# EAGLE schematic MotorControllerV2 (EAGLE 9.3.0)

## Sheet 1 of 2
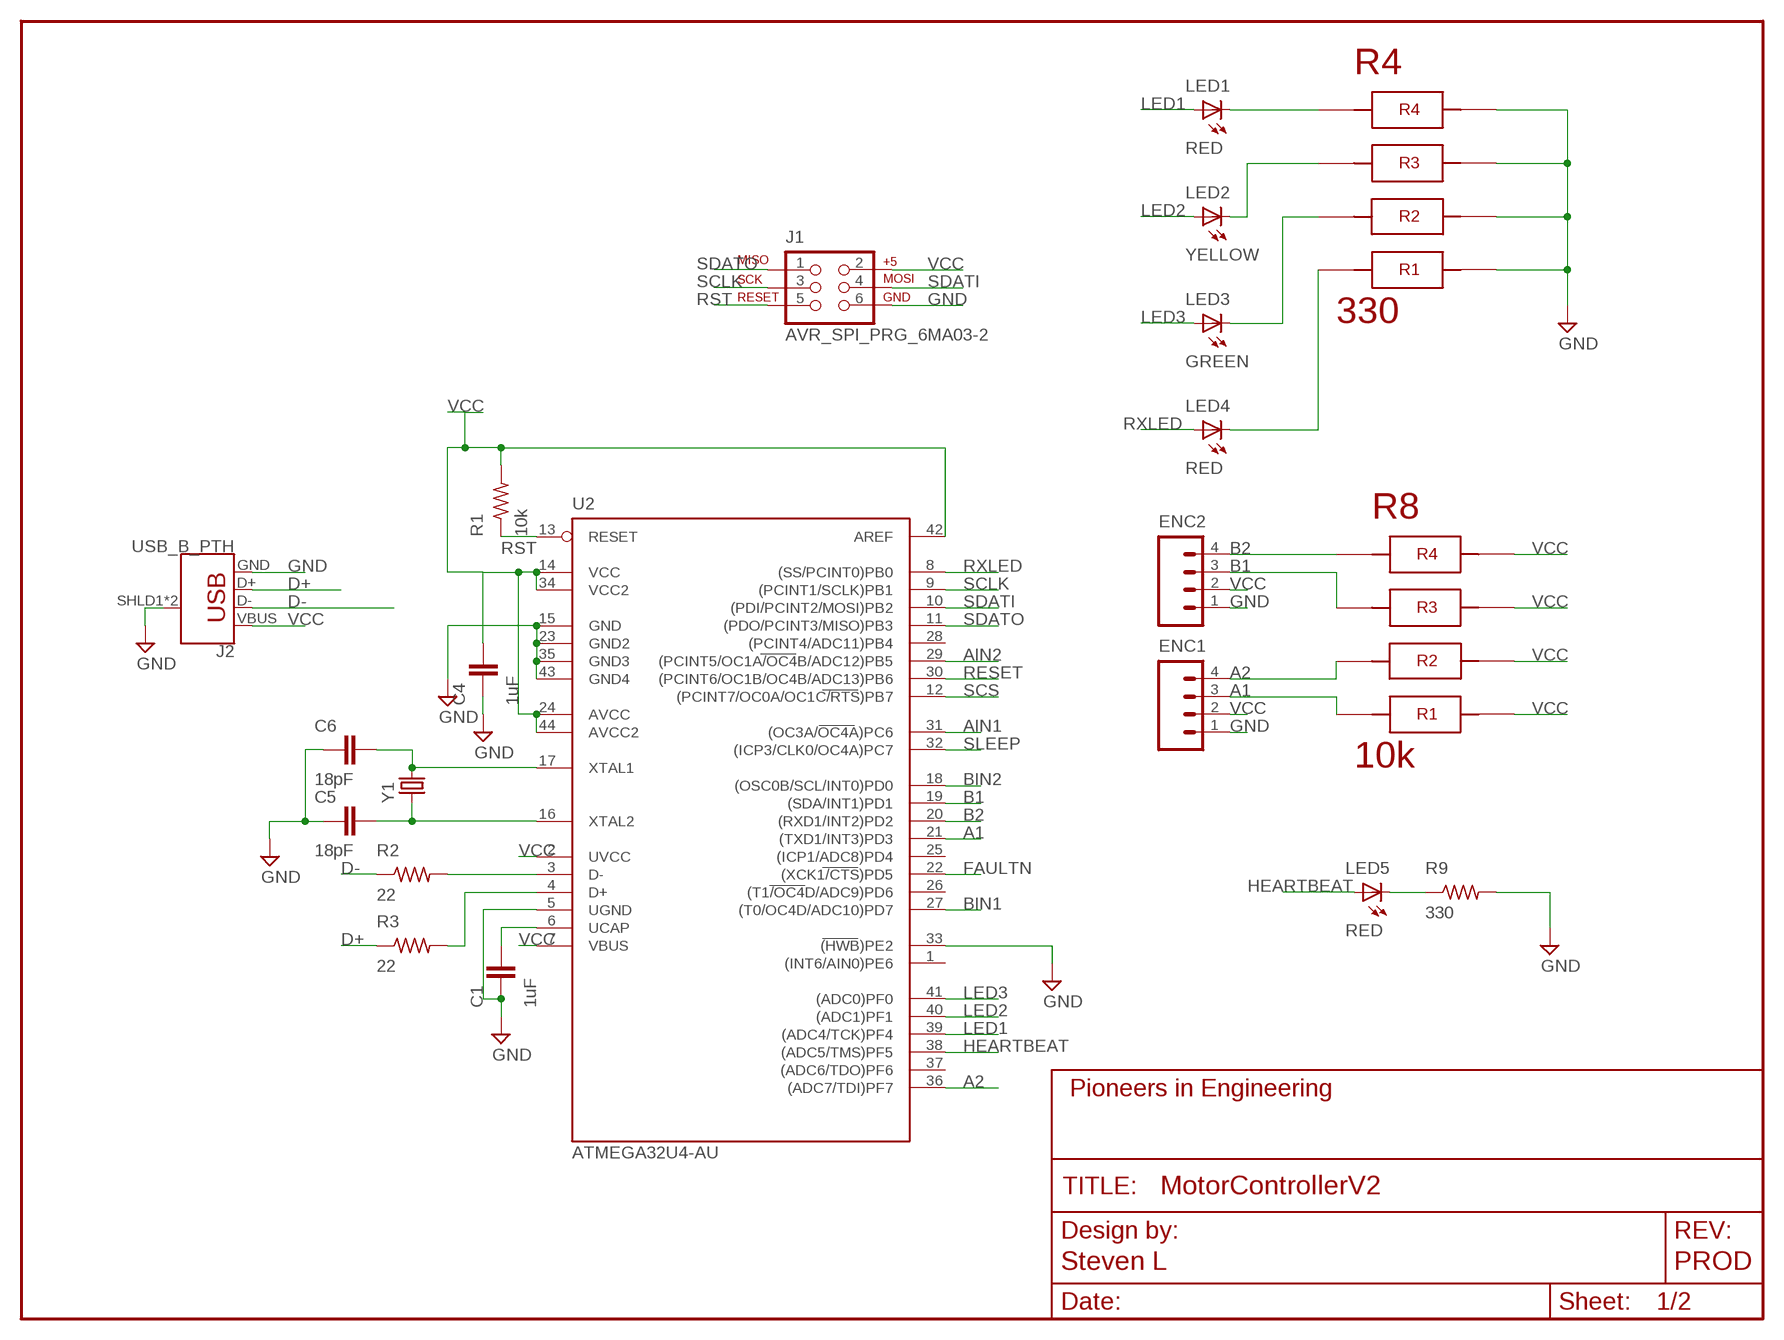
[diagram p0: schematic, sheet 1]
FRAME1 (FRAME_SCHEMATIC): AUTHOR: Steven L; REVISION: PROD

### Parts
C1  1uF  CAP0603-CAP  [0603-CAP]
C4  1uF  CAP0603-CAP  [0603-CAP]
C5  18pF  CAP0603-CAP  [0603-CAP]
C6  18pF  CAP0603-CAP  [0603-CAP]
ENC1  M041X04-MTA  [1X04-MTA]
ENC2  M041X04-MTA  [1X04-MTA]
J1  AVR_SPI_PRG_6MA03-2  [MA03-2]
J2  USB_B_PTH  [USB-B-PTH]
LED1  RED  LED1206  [LED-1206]
LED2  YELLOW  LED1206  [LED-1206]
LED3  GREEN  LED1206  [LED-1206]
LED4  RED  LED1206  [LED-1206]
LED5  RED  LED1206  [LED-1206]
R1  10k  R-US_R0603  [R0603]
R2  22  R-US_R0603  [R0603]
R3  22  R-US_R0603  [R0603]
R4  330  4X-0603  [4X-0603]
R8  10k  4X-0603  [4X-0603]
R9  330  R-US_R0603  [R0603]
U2  ATMEGA32U4-AU  [TQFP44]
Y1  CRYSTAL10.5X4.8  [CRYSTAL-SMD-10.5X4.8-2PIN]

### Nets
A1: ENC1.3 R8.8 U2.21((TXD1/INT3)PD3)
A2: ENC1.4 R8.7 U2.36((ADC7/TDI)PF7)
AIN1: U2.31((OC3A/OC4A)PC6) ; also sheet 2
AIN2: U2.29((PCINT5/OC1A/OC4B/ADC12)PB5) ; also sheet 2
B1: ENC2.3 R8.6 U2.19((SDA/INT1)PD1)
B2: ENC2.4 R8.5 U2.20((RXD1/INT2)PD2)
BIN1: U2.27((T0/OC4D/ADC10)PD7) ; also sheet 2
BIN2: U2.18((OSC0B/SCL/INT0)PD0) ; also sheet 2
D+: J2.D+ R3.1
D-: J2.D- R2.1
FAULTN: U2.22((XCK1/CTS)PD5) ; also sheet 2
GND: C1.1 C4.1 C5.1 C6.1 ENC1.1 ENC2.1 J1.6 J2.GND J2.SHLD1(SHIELD) J2.SHLD2(SHIELD) R4.1 R4.2 R4.3 R4.4 R9.2 U2.5(UGND) U2.15(GND) U2.23(GND2) U2.33((HWB)PE2) U2.35(GND3) U2.43(GND4) ; also sheet 2
HEARTBEAT: LED5.A U2.38((ADC5/TMS)PF5)
LED1: LED1.A U2.39((ADC4/TCK)PF4)
LED2: LED2.A U2.40((ADC1)PF1)
LED3: LED3.A U2.41((ADC0)PF0)
N$1: R2.2 U2.3(D-)
N$2: R3.2 U2.4(D+)
N$3: LED4.C R4.8
N$4: LED1.C R4.5
N$5: LED2.C R4.6
N$6: LED3.C R4.7
N$7: C6.2 U2.17(XTAL1) Y1.P$2
N$8: C5.2 U2.16(XTAL2) Y1.P$1
N$9: LED5.C R9.1
N$11: C1.2 U2.6(UCAP)
RESET: U2.30((PCINT6/OC1B/OC4B/ADC13)PB6) ; also sheet 2
RST: J1.5 R1.1 U2.13(RESET)
RXLED: LED4.A U2.8((SS/PCINT0)PB0)
SCLK: J1.3 U2.9((PCINT1/SCLK)PB1) ; also sheet 2
SCS: U2.12((PCINT7/OC0A/OC1C/RTS)PB7) ; also sheet 2
SDATI: J1.4 U2.10((PDI/PCINT2/MOSI)PB2) ; also sheet 2
SDATO: J1.1 U2.11((PDO/PCINT3/MISO)PB3) ; also sheet 2
SLEEP: U2.32((ICP3/CLK0/OC4A)PC7) ; also sheet 2
VCC: C4.2 ENC1.2 ENC2.2 J1.2 J2.VBUS R1.2 R8.1 R8.2 R8.3 R8.4 U2.2(UVCC) U2.7(VBUS) U2.14(VCC) U2.24(AVCC) U2.34(VCC2) U2.42(AREF) U2.44(AVCC2)
Unconnected: U2.1((INT6/AIN0)PE6) U2.25((ICP1/ADC8)PD4) U2.26((T1/OC4D/ADC9)PD6) U2.28((PCINT4/ADC11)PB4) U2.37((ADC6/TDO)PF6)

## Sheet 2 of 2
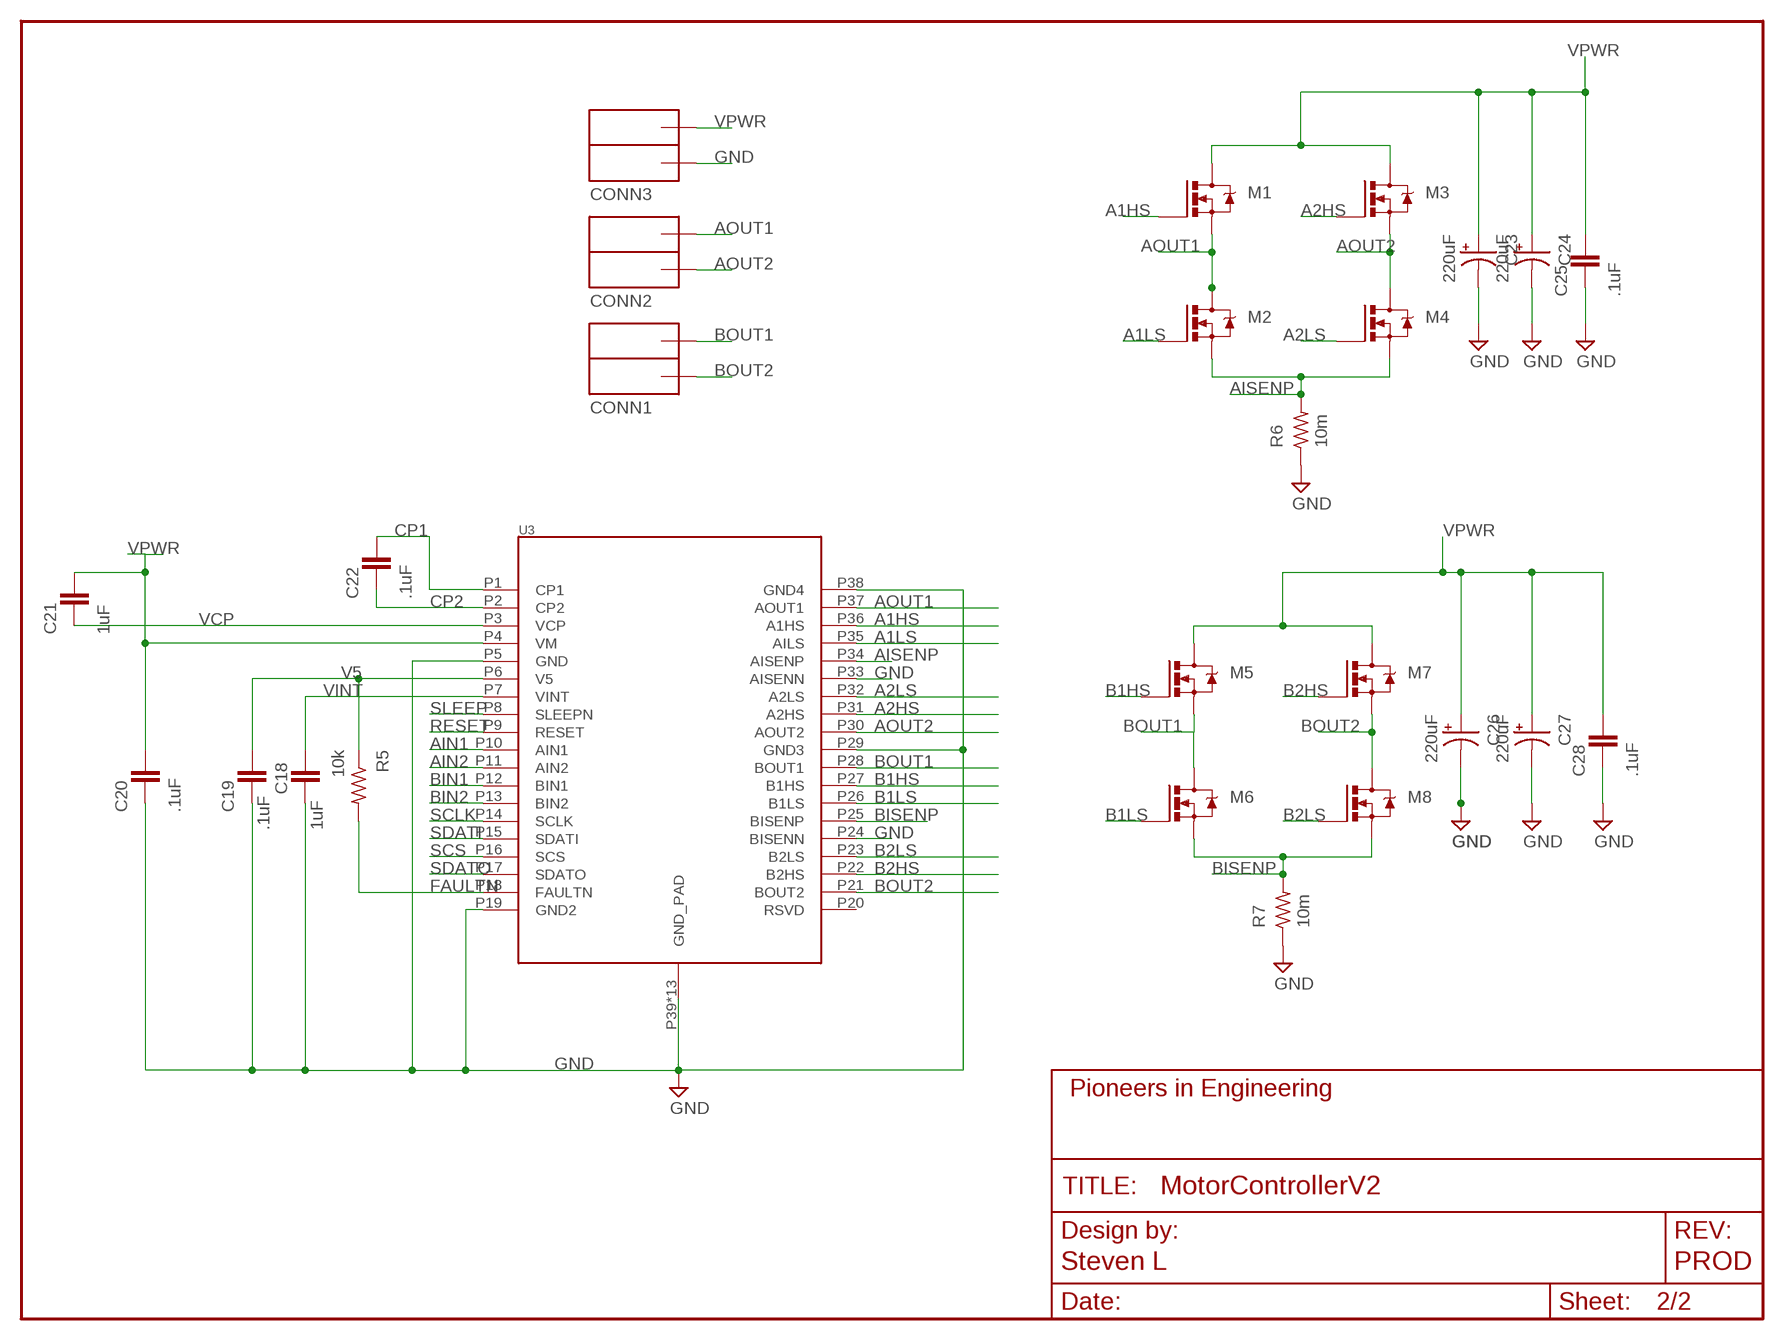
[diagram p1: schematic, sheet 2]
FRAME2 (FRAME_SCHEMATIC): AUTHOR: Steven L; REVISION: PROD

### Parts
C18  1uF  CAP0603-CAP  [0603-CAP]
C19  .1uF  CAP0603-CAP  [0603-CAP]
C20  .1uF  CAP0603-CAP  [0603-CAP]
C21  1uF  CAP0603-CAP  [0603-CAP]
C22  .1uF  CAP0603-CAP  [0603-CAP]
C23  220uF  CAP_POLF80  [NIPPON_F80]
C24  220uF  CAP_POLF80  [NIPPON_F80]
C25  .1uF  CAP0603-CAP  [0603-CAP]
C26  220uF  CAP_POLF80  [NIPPON_F80]
C27  220uF  CAP_POLF80  [NIPPON_F80]
C28  .1uF  CAP0603-CAP  [0603-CAP]
CONN1  ANDERSONVERTICAL  [ANDERSON_VERTICAL]
CONN2  ANDERSONVERTICAL  [ANDERSON_VERTICAL]
CONN3  ANDERSONVERTICAL  [ANDERSON_VERTICAL]
M1  NMOS_CSD17579Q3A  [DNH0008A]
M2  NMOS_CSD17579Q3A  [DNH0008A]
M3  NMOS_CSD17579Q3A  [DNH0008A]
M4  NMOS_CSD17579Q3A  [DNH0008A]
M5  NMOS_CSD17579Q3A  [DNH0008A]
M6  NMOS_CSD17579Q3A  [DNH0008A]
M7  NMOS_CSD17579Q3A  [DNH0008A]
M8  NMOS_CSD17579Q3A  [DNH0008A]
R5  10k  R-US_R0603  [R0603]
R6  10m  R-US_R2512  [R2512]
R7  10m  R-US_R2512  [R2512]
U3  DRV8704  [HTSSOP(38)]

### Nets
A1HS: M1.4(G) U3.P36(A1HS)
A1LS: M2.4(G) U3.P35(AILS)
A2HS: M3.4(G) U3.P31(A2HS)
A2LS: M4.4(G) U3.P32(A2LS)
AIN1: U3.P10(AIN1) ; also sheet 1
AIN2: U3.P11(AIN2) ; also sheet 1
AISENP: M2.1(S) M2.2(S) M2.3(S) M4.1(S) M4.2(S) M4.3(S) R6.2 U3.P34(AISENP)
AOUT1: CONN2.PIN1(OUTB) M1.1(S) M1.2(S) M1.3(S) M2.5(D) M2.6(D) M2.7(D) M2.8(D) M2.9(D) U3.P37(AOUT1)
AOUT2: CONN2.PIN2(OUTA) M3.1(S) M3.2(S) M3.3(S) M4.5(D) M4.6(D) M4.7(D) M4.8(D) M4.9(D) U3.P30(AOUT2)
B1HS: M5.4(G) U3.P27(B1HS)
B1LS: M6.4(G) U3.P26(B1LS)
B2HS: M7.4(G) U3.P22(B2HS)
B2LS: M8.4(G) U3.P23(B2LS)
BIN1: U3.P12(BIN1) ; also sheet 1
BIN2: U3.P13(BIN2) ; also sheet 1
BISENP: M6.1(S) M6.2(S) M6.3(S) M8.1(S) M8.2(S) M8.3(S) R7.2 U3.P25(BISENP)
BOUT1: CONN1.PIN1(OUTB) M5.1(S) M5.2(S) M5.3(S) M6.5(D) M6.6(D) M6.7(D) M6.8(D) M6.9(D) U3.P28(BOUT1)
BOUT2: CONN1.PIN2(OUTA) M7.1(S) M7.2(S) M7.3(S) M8.5(D) M8.6(D) M8.7(D) M8.8(D) M8.9(D) U3.P21(BOUT2)
CP1: C22.2 U3.P1(CP1)
CP2: C22.1 U3.P2(CP2)
FAULTN: R5.2 U3.P18(FAULTN) ; also sheet 1
GND: C18.1 C19.1 C20.1 C23.- C24.- C25.1 C26.- C27.- C28.1 CONN3.PIN2(OUTA) R6.1 R7.1 U3.P5(GND) U3.P19(GND2) U3.P24(BISENN) U3.P29(GND3) U3.P33(AISENN) U3.P38(GND4) U3.P39(GND_PAD) U3.P40(GND_PAD) U3.P41(GND_PAD) U3.P42(GND_PAD) U3.P43(GND_PAD) U3.P44(GND_PAD) U3.P45(GND_PAD) U3.P46(GND_PAD) U3.P47(GND_PAD) U3.P48(GND_PAD) U3.P49(GND_PAD) U3.P50(GND_PAD) U3.P51(GND_PAD) ; also sheet 1
RESET: U3.P9(RESET) ; also sheet 1
SCLK: U3.P14(SCLK) ; also sheet 1
SCS: U3.P16(SCS) ; also sheet 1
SDATI: U3.P15(SDATI) ; also sheet 1
SDATO: U3.P17(SDATO) ; also sheet 1
SLEEP: U3.P8(SLEEPN) ; also sheet 1
V5: C19.2 R5.1 U3.P6(V5)
VCP: C21.1 U3.P3(VCP)
VINT: C18.2 U3.P7(VINT)
VPWR: C20.2 C21.2 C23.+ C24.+ C25.2 C26.+ C27.+ C28.2 CONN3.PIN1(OUTB) M1.5(D) M1.6(D) M1.7(D) M1.8(D) M1.9(D) M3.5(D) M3.6(D) M3.7(D) M3.8(D) M3.9(D) M5.5(D) M5.6(D) M5.7(D) M5.8(D) M5.9(D) M7.5(D) M7.6(D) M7.7(D) M7.8(D) M7.9(D) U3.P4(VM)
Unconnected: U3.P20(RSVD)

## Library data of the parts
C1 C4-C6 C18-C21 C25 C28 = pie:CAP: Capacitor Standard 0603 ceramic capacitor, and 0.1" leaded capacitor.; PIE-INT-REF-NUM: CAPACITOR-GENERIC
C22 = pie:CAP: Capacitor Standard 0603 ceramic capacitor, and 0.1" leaded capacitor.; PIE-INT-REF-NUM: CAPACITOR-GENERIC; VMAX: 16V
C23 C24 C26 C27 = pie:CAP_POL: Capacitor Polarized These are standard SMD and PTH capacitors. Normally 10uF, 47uF, and 100uF in electrolytic and tantalum varieties. Always verify the external diameter of the through hole cap, it varies with capacity, voltage, and manufacturer. The EIA devices should be standard.
CONN1-CONN3 = pie:ANDERSON: 2-pin 25A Anderson Connector http://www.alliedelec.com/images/products/datasheets/bm/ANDERSON_POWER_PRODUCTS/70162018.pdf; PIE-INT-REF-NUM: Anderson
ENC1 ENC2 = pie:M04: 4-pin 0.1-inch header and MTA connector; PIE-INT-REF-NUM: MTA
J1 = pie:AVR_SPI_PRG_6: AVR ISP 6 Pin This is the reduced ISP connector for AVR programming. Common on Arduino. This footprint will take up less PCB space and can be used with a 10-pin to 6-pin adapter such as SKU: BOB-08508; PIE-INT-REF-NUM: BULK-STOCK
J2 = SparkFun-Connectors:USB_B: USB Type B Connector SparkFun Products: SparkFun Stepoko <https://www.sparkfun.com/products/13899> PTH; PROD_ID: CONN-08278; SF_ID: PRT-00139
LED1-LED5 = pie:LED: LEDs Standard schematic elements and footprints for 5mm, 3mm, 1206, and 0603 sized LEDs. 5mm - Spark Fun Electronics SKU : COM-00529 (and others); PIE-INT-REF-NUM: LED
M1-M8 = pie:NMOS_CSD17579Q3A; PART_NO: CSD17579Q3A
R1-R3 R5 R9 = pie:R-US_: RESISTOR, American symbol; DESCRIPTION: RESISTOR, American symbol; DISTRIBUTOR: DigiKey; MANUFACTURER: Rohm Semiconductor; NOTES: Cut Tape; PACKAGE: R0603; VALUE: >VALUE
R4 R8 = pie:4X-0603: 330: https://www.digikey.com/product-detail/en/panasonic-electronic-components/EXB-38V331JV/Y9331CT-ND/256586 10k: https://www.digikey.com/product-detail/en/panasonic-electronic-components/EXB-38V103JV/Y9103CT-ND/256604
R6 R7 = pie:R-US_: RESISTOR, American symbol; PIE-INT-REF-NUM: RESISTOR-GENERIC
U2 = pie:ATMEGA32U4-AU; PIE-DIGIKEY-PN-ALT1: ATMEGA32U4-MURCT-ND; PIE-DIGIKEY-PN-PRI: ATMEGA32U4RC-MURCT-ND; PIE-INT-REF-NUM: ATmega32U4
U3 = pie:DRV8704; PART_NO: DRV8704
Y1 = pie:CRYSTAL: Various standard crystals. Proven footprints. Spark Fun Electronics SKU : COM-00534; PIE-INT-REF-NUM: CRYSTAL